# Altium schematic sheet Sheet1.SchDoc
size A; SheetNumber: 1; SheetTotal: 1
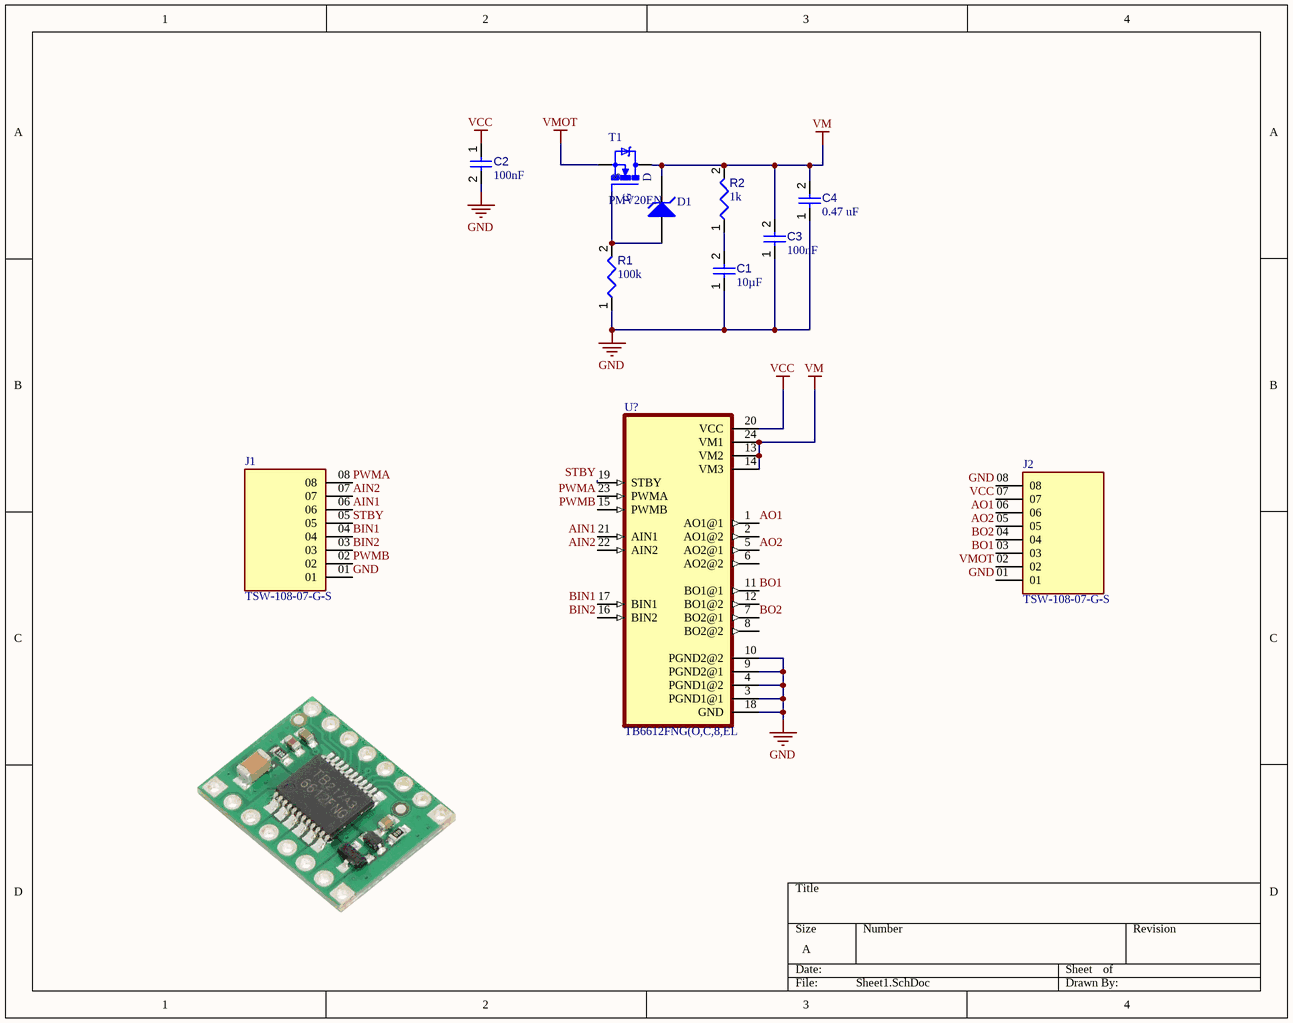
[diagram p0: Sheet1.SchDoc]

## Parts
C1  value 10µF  [CAPC2013X135X45NL10T25]  (hidden comment: Capacitor 10 uF +/- 10% 16 V 0805)
C2  value 100nF  [CAPC1005X56X25LL10T15]  (hidden comment: Capacitor 0.1 uF +/- 5% 16 V 0402)
C3  value 100nF  [CAPC1005X56X25LL10T15]  (hidden comment: Capacitor 0.1 uF +/- 5% 16 V 0402)
C4  value 0.47 uF  [CAPC1005X56X25ML10T15]  (hidden comment: Capacitor 0.5 pF +/- 0.1pF 25 V 0402)
D1  CESD5V0D1  [JSCJ-SOD-123-2_V]  (value not drawn)
J1  TSW-108-07-G-S  [SAMTEC_TSW-108-07-G-S]
J2  TSW-108-07-G-S  [SAMTEC_TSW-108-07-G-S]
R1  value 100k  [RESC0402(1005)_L]  (hidden comment: 100KR2F)
R2  value 1k  [RESC0402(1005)_L]  (hidden comment: Resistor 9K1  +/-5 % 0402 63 mW)
T1  PMV20EN  [SOT23-BEC]
U?  TB6612FNG(O,C,8,EL  [SOP65P760X160-24N]

## Nets
GND: C1.1 C2.2 C3.1 C4.1 J1.01 J2.01 J2.08 R1.1 U?.3(PGND1@1) U?.4(PGND1@2) U?.9(PGND2@1) U?.10(PGND2@2) U?.18(GND)
VCC: C2.1 J2.07 U?.20(VCC)
VM: C3.2 C4.2 D1.2(K) R2.2 T1.C(D) U?.13(VM2) U?.14(VM3) U?.24(VM1)
VMOT: J2.02 T1.E(S)
AIN1: J1.06 U?.21(AIN1)
AIN2: J1.07 U?.22(AIN2)
AO1: J2.06 U?.1(AO1@1)
AO2: J2.05 U?.5(AO2@1)
BIN1: J1.04 U?.17(BIN1)
BIN2: J1.03 U?.16(BIN2)
BO1: J2.03 U?.11(BO1@1)
BO2: J2.04 U?.7(BO2@1)
PWMA: J1.08 U?.23(PWMA)
PWMB: J1.02 U?.15(PWMB)
STBY: J1.05 U?.19(STBY)
NetC1_2: C1.2 R2.1
NetD1_1: D1.1(A) R1.2 T1.B(G)

Not connected (* = marked no-connect by the designer): U? 2(AO1@2) 6(AO2@2) 8(BO2@2) 12(BO1@2)

## Library data of the parts
C1 = CMP-001-00015-6: Chip Capacitor, 10 uF, +/- 10%, 16 V, 0805 (2012 Metric); Voltage Rating: 16V; Capacitor Type: Ceramic; RoHS Compliant: True; Max Operating Temperature: 85°C; Min Operating Temperature: -55°C; Mounting Technology: SM; Tolerance: 10%; Case/Package: 0805; Pins: 2
C2 C3 = CMP-001-00001-6: Chip Capacitor, 0.1 uF, +/- 5%, 16 V, 0402 (1005 Metric); Capacitor Type: Ceramic; Voltage Rating: 16V; Max Operating Temperature: 125°C; Min Operating Temperature: -55°C; Case/Package: 0402; Mounting Technology: SM; Pins: 2; Tolerance: 5%; RoHS Compliant: True
C4 = CMP-001-00002-6: Chip Capacitor, 0.5 pF, +/- 0.1pF, 25 V, 0402 (1005 Metric); Voltage Rating: 25V; Tolerance: 20%; Capacitor Type: Ceramic; Max Operating Temperature: 125°C; Case/Package: 0402; Pins: 2; RoHS Compliant: True; Min Operating Temperature: -55°C; Mounting Technology: SM
D1 = CMP-004-00020-2: Uni-driection ESD Protection Diode, 5 V, 1 uA, 2-Pin SOD-123, RoHS, Tape and Reel; Manufacturer: Jiangsu Changjiang Electronics Technology; Datasheet URL: http://www.cj-elec.com/gallery/txUpfile/f05a5831e2d7f622a930855050fbe076.pdf; Datasheet Version: Rev. B, 04/2014; Package Description: 2-Pin Surface Mount Device, Body 2.7 x 1.6 mm; Package Reference: SOD-123-2; RoHS Compliant: Unknown; Package URL: http://www.cj-elec.com/txUpfile/201412112231195145.pdf; Case/Package: SOD-123-2; Mounting Technology: SM
J1 J2 = TSW-108-07-G-S: MF: Samtec; Availability: Unavailable; Package: None; MP: TSW-108-07-G-S; Value: *; Price: None
R1 = CMP-009-00064-2: 100K 0.063W 1% 0402 (1005 Metric)  SMD; Power: 63mW; Case/Package: 0402; Mounting Technology: SMT; Pins: 2; Tolerance: 1%
R2 = CMP-009-00135-3: Chip Resistor, 9,1 kOhms, +/-5 %, 63 mW, -55 to 155 degC, 0402; Power: 63mW; Tolerance: 5%; Pins: 2; Case/Package: 0402; Max Operating Temperature: 155°C; Min Operating Temperature: -55°C
T1 = PMV20EN: MOSFET, N-CH, 30V, 7.6A, SOT-23-3; MF: NXP Semiconductors; SnapEDA_Link: https://www.snapeda.com/parts/PMV20EN/NXP+Semiconductors/view-part/?ref=snap; Package: SOT-23-3 NXP Semiconductors; Value: *; MP: PMV20EN; Check_prices: https://www.snapeda.com/parts/PMV20EN/NXP+Semiconductors/view-part/?ref=eda
U? = TB6612FNG(O,C,8,EL: DC Motor Driver 3V 24-Pin SSOP T/R; MF: Toshiba; Check_prices: https://www.snapeda.com/parts/TB6612FNG(O,C,8,EL/Toshiba/view-part/?ref=eda; Package: SSOP-24 Toshiba; Availability: Not in stock; Value: *; MP: TB6612FNG(O,C,8,EL; SnapEDA_Link: https://www.snapeda.com/parts/TB6612FNG(O,C,8,EL/Toshiba/view-part/?ref=snap; Price: None